# Altium project notSoFitFanny.PrjPcb
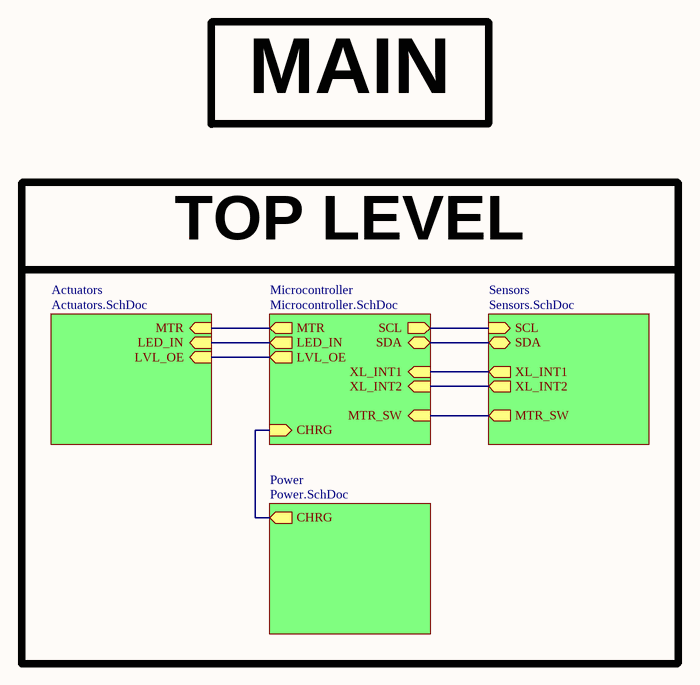
[diagram p0: Main.SchDoc]
5 sheets, 61 parts. Net scope: hierarchical (ports join the sheet entries above them; power ports are global).
Sheets:
  Main.SchDoc
    Microcontroller = Microcontroller.SchDoc
    Sensors = Sensors.SchDoc
    Actuators = Actuators.SchDoc
    Power = Power.SchDoc

## Sheet Main.SchDoc
size A; DocumentNumber: 1; SheetNumber: 1; SheetTotal: 5

### Parts
LOGO  SM Logo  [smLogo_10]  (value not drawn)  (no BOM)

### Sub-sheets
Actuators = Actuators.SchDoc: MTR (in), LVL_OE (in), LED_IN (in)
Microcontroller = Microcontroller.SchDoc: SCL (out), SDA, CHRG (in), MTR (out), LVL_OE (out), LED_IN (out), MTR_SW (in), XL_INT1 (in), XL_INT2 (in)
Power = Power.SchDoc: CHRG (out)
Sensors = Sensors.SchDoc: SCL (in), SDA, MTR_SW (out), XL_INT1 (out), XL_INT2 (out)

### Nets
CHRG: sheet Microcontroller/CHRG, sheet Power/CHRG
LED_IN: sheet Microcontroller/LED_IN, sheet Actuators/LED_IN
LVL_OE: sheet Microcontroller/LVL_OE, sheet Actuators/LVL_OE
MTR: sheet Microcontroller/MTR, sheet Actuators/MTR
MTR_SW: sheet Microcontroller/MTR_SW, sheet Sensors/MTR_SW
SCL: sheet Microcontroller/SCL, sheet Sensors/SCL
SDA: sheet Microcontroller/SDA, sheet Sensors/SDA
XL_INT1: sheet Microcontroller/XL_INT1, sheet Sensors/XL_INT1
XL_INT2: sheet Microcontroller/XL_INT2, sheet Sensors/XL_INT2

### Notes on the sheet
- MAIN
- TOP LEVEL

### Library data of the parts
LOGO = smLogo

## Sheet Microcontroller.SchDoc
size A; DocumentNumber: 2; SheetNumber: 2; SheetTotal: 5
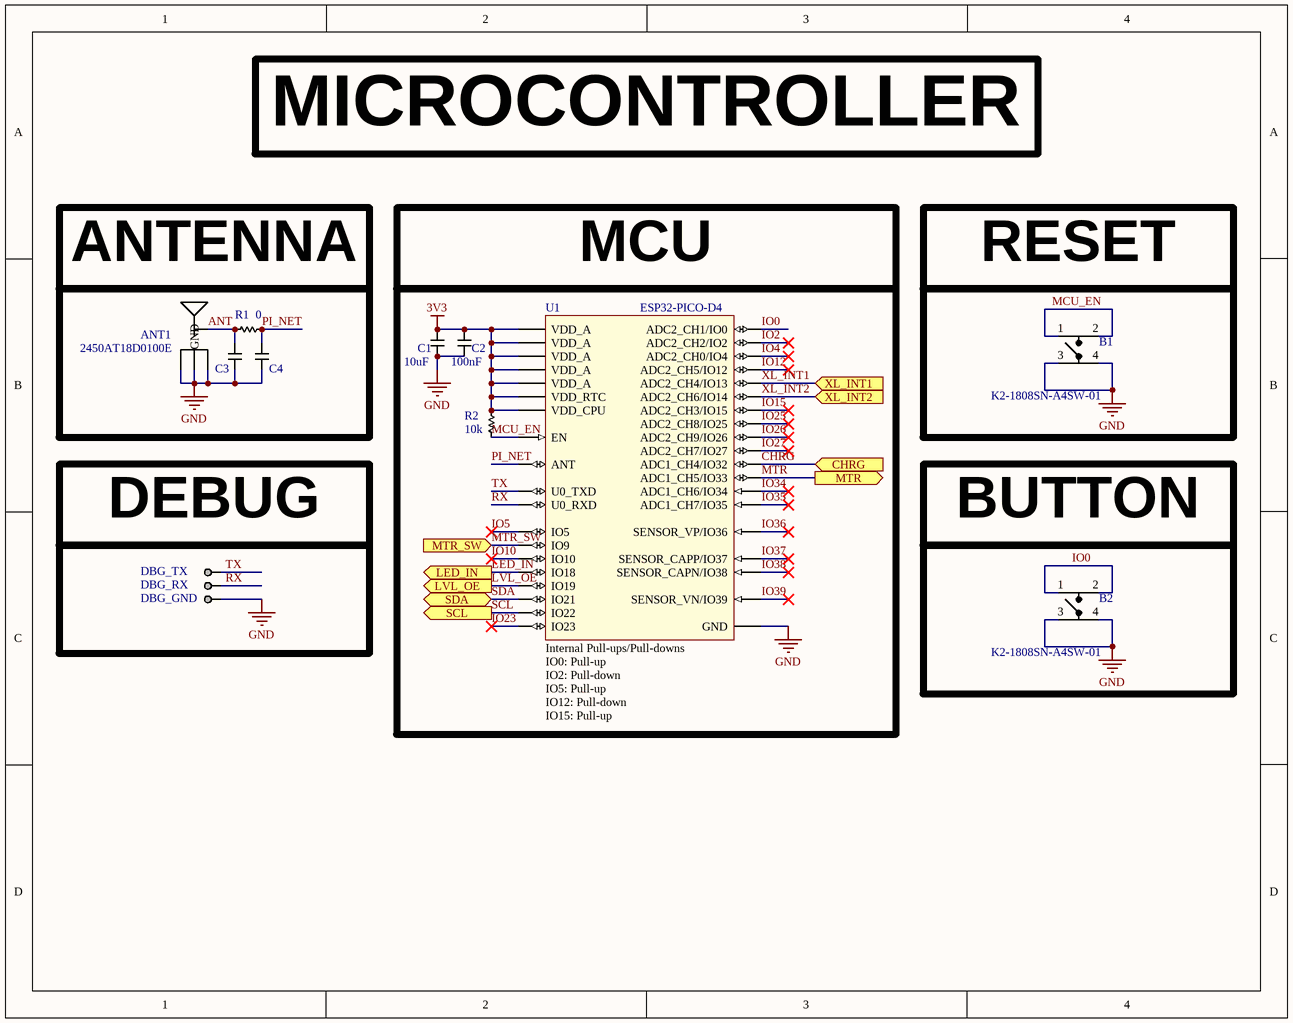
[diagram p1: Microcontroller.SchDoc]

### Parts
ANT1  2450AT18D0100E  [2450AT18D0100E_RH]
B1  K2-1808SN-A4SW-01  [K2-1808SN-A4SW-01]
B2  K2-1808SN-A4SW-01  [K2-1808SN-A4SW-01]
C1  10uF  [CAP_0603_HIGH]
C2  100nF  [CAP_0402_HIGH]
C3  C  [CAP_0402_HIGH]  (value not drawn)  (no BOM)
C4  C  [CAP_0402_HIGH]  (value not drawn)  (no BOM)
DBG_GND  0.1" Header  [0.1" Header]  (value not drawn)  (no BOM)
DBG_RX  0.1" Header  [0.1" Header]  (value not drawn)  (no BOM)
DBG_TX  0.1" Header  [0.1" Header]  (value not drawn)  (no BOM)
R1  0  [RES_0402_HIGH]
R2  10k  [RES_0402_HIGH]
U1  ESP32-PICO-D4  [ESP32-PICO-D4]

### Ports
CHRG (in), LED_IN (out), LVL_OE (out), MTR (out), MTR_SW (in), SCL (out), SDA, XL_INT1 (in), XL_INT2 (in)

### Nets
3V3: C1.2 C2.2 R2.2 U1.1(VDD_A) U1.3(VDD_A) U1.4(VDD_A) U1.19(VDD_RTC) U1.37(VDD_CPU) U1.43(VDD_A) U1.46(VDD_A)
GND: ANT1.2(GND) ANT1.3(GND) ANT1.4(GND) B1.3 B1.4 B2.3 B2.4 C1.1 C2.1 C3.1 C4.1 DBG_GND.1 U1.49(GND)
ANT: ANT1.1(FEED) C3.2 R1.1
CHRG: U1.12(ADC1_CH4/IO32) ; port CHRG
IO0: B2.1 B2.2 U1.23(ADC2_CH1/IO0)
IO2: U1.22(ADC2_CH2/IO2)
IO4: U1.24(ADC2_CH0/IO4)
IO5: U1.34(IO5)
IO10: U1.29(IO10)
IO12: U1.18(ADC2_CH5/IO12)
IO15: U1.21(ADC2_CH3/IO15)
IO23: U1.36(IO23)
IO25: U1.14(ADC2_CH8/IO25)
IO26: U1.15(ADC2_CH9/IO26)
IO27: U1.16(ADC2_CH7/IO27)
IO34: U1.10(ADC1_CH6/IO34)
IO35: U1.11(ADC1_CH7/IO35)
IO36: U1.5(SENSOR_VP/IO36)
IO37: U1.6(SENSOR_CAPP/IO37)
IO38: U1.7(SENSOR_CAPN/IO38)
IO39: U1.8(SENSOR_VN/IO39)
LED_IN: U1.35(IO18) ; port LED_IN
LVL_OE: U1.38(IO19) ; port LVL_OE
MCU_EN: B1.1 B1.2 R2.1 U1.9(EN)
MTR: U1.13(ADC1_CH5/IO33) ; port MTR
MTR_SW: U1.28(IO9) ; port MTR_SW
PI_NET: C4.2 R1.2 U1.2(ANT)
RX: DBG_RX.1 U1.40(U0_RXD)
SCL: U1.39(IO22) ; port SCL
SDA: U1.42(IO21) ; port SDA
TX: DBG_TX.1 U1.41(U0_TXD)
XL_INT1: U1.20(ADC2_CH4/IO13) ; port XL_INT1
XL_INT2: U1.17(ADC2_CH6/IO14) ; port XL_INT2

### Notes on the sheet
- MICROCONTROLLER
- ANTENNA
- MCU
- (near B1) RESET
- DEBUG
- (near B2) BUTTON
- (in symbol ESP32-PICO-D4) Internal Pull-ups/Pull-downs / IO0: Pull-up / IO2: Pull-down / IO5: Pull-up / IO12: Pull-down / IO15: Pull-up /

### Library data of the parts
ANT1 = 2450AT18D0100E_RH: 2450AT18D0100E 2.4GHz  Chip RF Antenna 2.4GHz ~ 2.5GHz 1.5dBi Solder Surface Mount
B1 B2 = K2-1808SN-A4SW-01: K2-1808SN-A4SW-01 Tactile Switch SPST-NO Top Actuated Surface Mount
C1 = Capacitor_0603: 0603 Capacitor
C2-C4 = Capacitor_0402: 0402 Capacitor
R1 R2 = Resistor_0402: 0402 Resistor
U1 = ESP32-PICO-D4: ESP32-PICO-D4 SoC

## Sheet Sensors.SchDoc
size A; DocumentNumber: 3; SheetNumber: 3; SheetTotal: 5
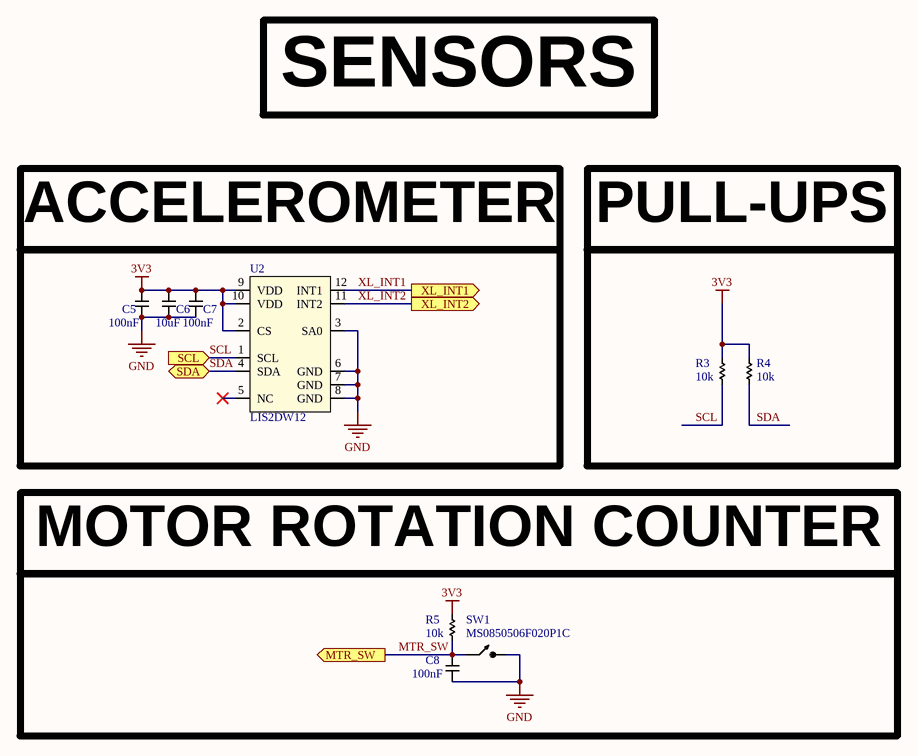
[diagram p2: Sensors.SchDoc]

### Parts
C5  100nF  [CAP_0402_HIGH]
C6  10uF  [CAP_0603_HIGH]
C7  100nF  [CAP_0402_HIGH]
C8  100nF  [CAP_0402_HIGH]
R3  10k  [RES_0402_HIGH]
R4  10k  [RES_0402_HIGH]
R5  10k  [RES_0402_HIGH]
SW1  MS0850506F020P1C  [MS0850506F020P1C]
U2  LIS2DW12  [LIS2DW12]

### Ports
MTR_SW (out), SCL (in), SDA, XL_INT1 (out), XL_INT2 (out)

### Nets
3V3: C5.2 C6.2 C7.2 R3.2 R4.2 R5.2 U2.2(CS) U2.9(VDD) U2.10(VDD)
GND: C5.1 C6.1 C7.1 C8.1 SW1.2 U2.3(SA0) U2.6(GND) U2.7(GND) U2.8(GND)
MTR_SW: C8.2 R5.1 SW1.1 ; port MTR_SW
SCL: R3.1 U2.1(SCL) ; port SCL
SDA: R4.1 U2.4(SDA) ; port SDA
XL_INT1: U2.12(INT1) ; port XL_INT1
XL_INT2: U2.11(INT2) ; port XL_INT2

Not connected (* = marked no-connect by the designer): U2 5(NC)*

### Notes on the sheet
- SENSORS
- ACCELEROMETER
- PULL-UPS
- (near R5) MOTOR ROTATION COUNTER

### Library data of the parts
C5 C7 C8 = Capacitor_0402: 0402 Capacitor
C6 = Capacitor_0603: 0603 Capacitor
R3-R5 = Resistor_0402: 0402 Resistor
SW1 = MS0850506F020P1C: MS0850506F020P1C SWITCH SNAP ACT SPST-NO 5A 125V
U2 = LIS2DW12: LIS2DW12 Accelerometer X, Y, Z Axis ±2g, 4g, 8g, 16g 400Hz 12-LGA (2x2)

## Sheet Actuators.SchDoc
size A; DocumentNumber: 4; SheetNumber: 4; SheetTotal: 5
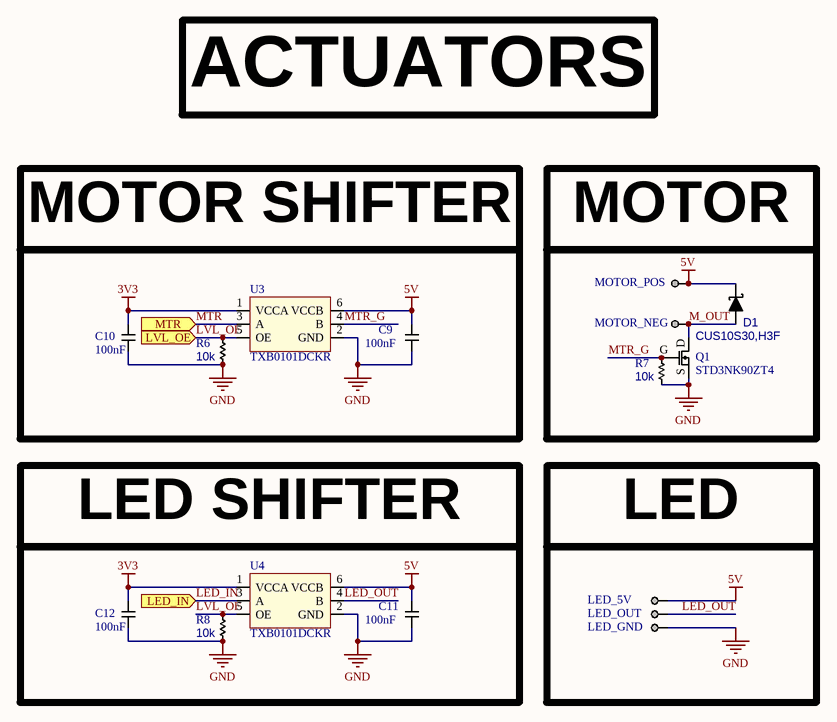
[diagram p3: Actuators.SchDoc]

### Parts
C9  100nF  [CAP_0402_HIGH]
C10  100nF  [CAP_0402_HIGH]
C11  100nF  [CAP_0402_HIGH]
C12  100nF  [CAP_0402_HIGH]
D1  CUS10S30,H3F  [CUS10S30,H3F]
LED_5V  18 AWG Hole  [18 AWG Hole]  (value not drawn)  (no BOM)
LED_GND  18 AWG Hole  [18 AWG Hole]  (value not drawn)  (no BOM)
LED_OUT  18 AWG Hole  [18 AWG Hole]  (value not drawn)  (no BOM)
MOTOR_NEG  18 AWG Hole  [18 AWG Hole]  (value not drawn)  (no BOM)
MOTOR_POS  18 AWG Hole  [18 AWG Hole]  (value not drawn)  (no BOM)
Q1  STD3NK90ZT4  [STD3NK90ZT4]
R6  10k  [RES_0402_HIGH]
R7  10k  [RES_0402_HIGH]
R8  10k  [RES_0402_HIGH]
U3  TXB0101DCKR  [TXB0101DCKR]
U4  TXB0101DCKR  [TXB0101DCKR]

### Ports
LED_IN (in), LVL_OE (in), MTR (in)

### Nets
3V3: C10.2 C12.2 U3.1(VCCA) U4.1(VCCA)
5V: C9.2 C11.2 D1.1 LED_5V.1 MOTOR_POS.1 U3.6(VCCB) U4.6(VCCB)
GND: C9.1 C10.1 C11.1 C12.1 LED_GND.1 Q1.S R6.1 R7.1 R8.1 U3.2(GND) U4.2(GND)
LED_IN: U4.3(A) ; port LED_IN
LED_OUT: LED_OUT.1 U4.4(B)
LVL_OE: R6.2 R8.2 U3.5(OE) U4.5(OE) ; port LVL_OE
M_OUT: D1.2 MOTOR_NEG.1 Q1.D
MTR: U3.3(A) ; port MTR
MTR_G: Q1.G R7.2 U3.4(B)

### Notes on the sheet
- ACTUATORS
- MOTOR SHIFTER
- MOTOR
- LED SHIFTER
- LED

### Library data of the parts
C9-C12 = Capacitor_0402: 0402 Capacitor
D1 = CUS10S30,H3F: CUS10S30,H3F Diode Schottky 30V 1A Surface Mount USC
Q1 = STD3NK90ZT4: STD3NK90ZT4 N-Channel 900 V 3A (Tc) 90W (Tc) Surface Mount DPAK
R6-R8 = Resistor_0402: 0402 Resistor
U3 U4 = TXB0101DCKR: TXB0101DCKR Voltage Level Translator Bidirectional 1 Circuit 1 Channel 100Mbps SC-70-6

## Sheet Power.SchDoc
size A; DocumentNumber: 5; SheetNumber: 5; SheetTotal: 5
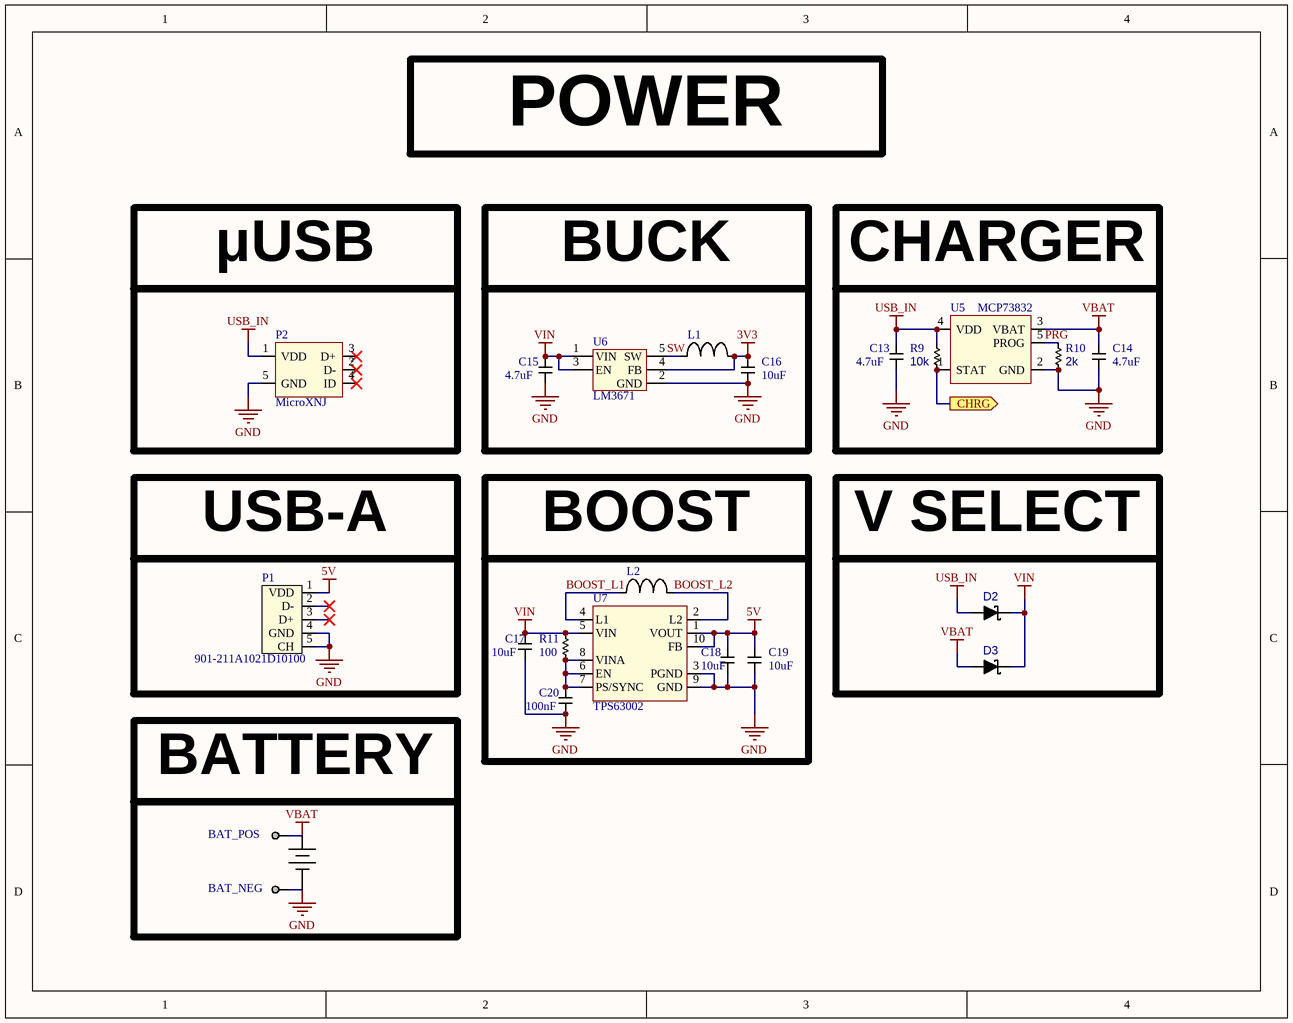
[diagram p4: Power.SchDoc]

### Parts
BAT_NEG  18 AWG Hole  [18 AWG Hole]  (value not drawn)  (no BOM)
BAT_POS  18 AWG Hole  [18 AWG Hole]  (value not drawn)  (no BOM)
C13  4.7uF  [CAP_0402_HIGH]
C14  4.7uF  [CAP_0402_HIGH]
C15  4.7uF  [CAP_0603_HIGH]
C16  10uF  [CAP_0603_HIGH]
C17  10uF  [CAP_0603_HIGH]
C18  10uF  [CAP_0603_HIGH]
C19  10uF  [CAP_0603_HIGH]
C20  100nF  [CAP_0402_HIGH]
D2  CUS10S30,H3F  [CUS10S30,H3F]  (value not drawn)
D3  CUS10S30,H3F  [CUS10S30,H3F]  (value not drawn)
L1  YNR3015-2R2M  [YNR3015-2R2M]  (value not drawn)
L2  YNR3015-2R2M  [YNR3015-2R2M]  (value not drawn)
P1  901-211A1021D10100  [901-211A1021D10100]
P2  MicroXNJ  [MicroXNJ]
R9  10k  [RES_0402_HIGH]
R10  2k  [RES_0402_HIGH]
R11  100  [RES_0402_HIGH]
U5  MCP73832  [MCP73831]
U6  LM3671  [LM3671-SOT23]
U7  TPS63002  [TPS63001]

### Ports
CHRG (out)

### Nets
3V3: C16.2 L1.2 U6.4(FB)
5V: C18.2 C19.2 P1.1(VDD) U7.1(VOUT) U7.10(FB)
GND: BAT_NEG.1 C13.1 C14.1 C15.1 C16.1 C17.1 C18.1 C19.1 C20.1 P1.4(GND) P1.5(CH) P2.5(GND) R10.2 U5.2(GND) U6.2(GND) U7.3(PGND) U7.9(GND)
USB_IN: C13.2 D2.2 P2.1(VDD) R9.1 U5.4(VDD)
VBAT: BAT_POS.1 C14.2 D3.2 U5.3(VBAT)
VIN: C15.2 C17.2 D2.1 D3.1 R11.2 U6.1(VIN) U6.3(EN) U7.5(VIN)
BOOST_L1: L2.1 U7.4(L1)
BOOST_L2: L2.2 U7.2(L2)
CHRG: R9.2 U5.1(STAT) ; port CHRG
PRG: R10.1 U5.5(PROG)
SW: L1.1 U6.5(SW)
NetC20_2: C20.2 R11.1 U7.6(EN) U7.7(PS/SYNC) U7.8(VINA)

Not connected (* = marked no-connect by the designer): P1 2(D-)* 3(D+)*; P2 2(D-)* 3(D+)* 4(ID)*

### Notes on the sheet
- POWER
- μUSB
- BUCK
- CHARGER
- (near P1) USB-A
- (near L2) BOOST
- V SELECT
- (near BAT_POS) BATTERY

### Library data of the parts
C13 C14 C20 = Capacitor_0402: 0402 Capacitor
C15-C19 = Capacitor_0603: 0603 Capacitor
D2 D3 = CUS10S30,H3F: as D1 on sheet Actuators
L1 L2 = YNR3015-2R2M: YNR3015-2R2M 2.2uH ±20% 1.6A 30mΩ SMD,3.0x3.0x1.5mm Power Inductors RoHS
P1 = 901-211A1021D10100: 901-211A1021D10100 USB - Type A Female USB 2.0 4 Through Hole USB Connectors RoHS
P2 = MicroXNJ: MicroXNJ USB - micro B USB 2.0 Receptacle Connector 5 Position Surface Mount, Right Angle; Through Hole
R9-R11 = Resistor_0402: 0402 Resistor
U5 = MCP73831: MCP73831 Charger IC Lithium-Ion/Polymer
U6 = LM3671: LM3671 IC REG BUCK 3.3V 0.6A SYNC 5USMD
U7 = TPS63001: TPS63001 Buck-Boost Switching Regulator IC Positive Fixed 5V 1 Output 1.6A (Switch) 10-VFDFN Exposed Pad

## Nets that join several sheets
3V3: Microcontroller (10 pins), Sensors (9 pins), Actuators (C10.2 C12.2 U3.1 U4.1), Power (C16.2 L1.2 U6.4)
5V: Actuators (7 pins), Power (5 pins)
GND: Microcontroller (13 pins), Sensors (9 pins), Actuators (11 pins), Power (17 pins)
CHRG: Microcontroller (U1.12), Power (R9.2 U5.1)
LED_IN: Microcontroller (U1.35), Actuators (U4.3)
LVL_OE: Microcontroller (U1.38), Actuators (R6.2 R8.2 U3.5 U4.5)
MTR: Microcontroller (U1.13), Actuators (U3.3)
MTR_SW: Microcontroller (U1.28), Sensors (C8.2 R5.1 SW1.1)
SCL: Microcontroller (U1.39), Sensors (R3.1 U2.1)
SDA: Microcontroller (U1.42), Sensors (R4.1 U2.4)
XL_INT1: Microcontroller (U1.20), Sensors (U2.12)
XL_INT2: Microcontroller (U1.17), Sensors (U2.11)